# Altium schematic sheet FPGA_GTXqs.SchDoc
size B; SheetNumber: 10; SheetTotal: 11
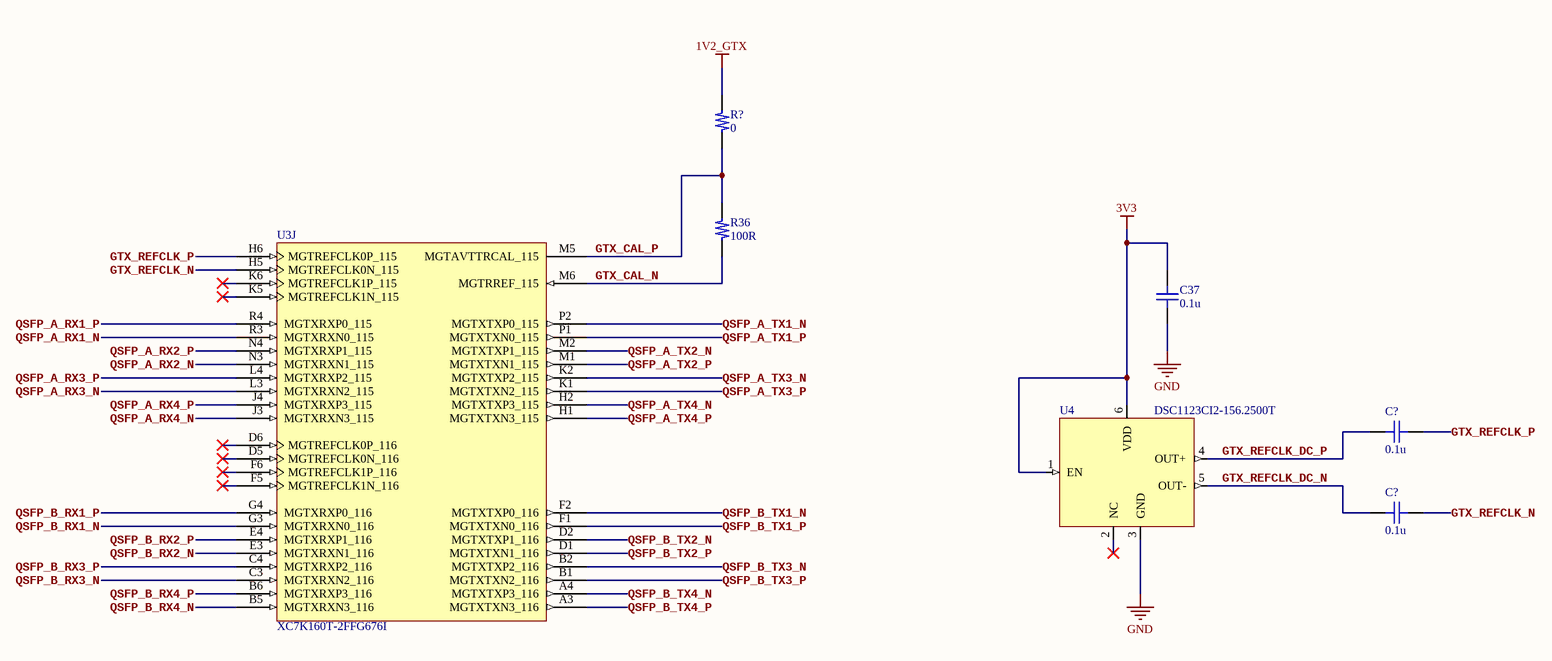
[diagram p0: FPGA_GTXqs.SchDoc]

## Parts
(Parts that share a designator on the sheet are numbered #1, #2 ... from top to bottom, then left to right.)
C37  0.1u  [C_0402_Generic]
C?#1  0.1u  [C_0402_Generic]
C?#2  0.1u  [C_0402_Generic]
R36  100R  [R_0402_Generic]
R?  0  [R_0402_Generic]
U3  XC7K160T-2FFG676I  [FFG676_(XC7K160T-2FFG676I)]  (part J of 14)
U4  DSC1123CI2-156.2500T  [Microchip_DSC1123CI2]

## Nets
1V2_GTX: R?.2
3V3: C37.2 U4.1(EN) U4.6(VDD)
GND: C37.1 U4.3(GND)
GTX_CAL_N: R36.2 U3.M6(MGTRREF_115)
GTX_CAL_P: R36.1 R?.1 U3.M5(MGTAVTTRCAL_115)
GTX_REFCLK_DC_N: C?#2.2 U4.5(OUT-)
GTX_REFCLK_DC_P: C?#1.2 U4.4(OUT+)
GTX_REFCLK_N: C?#2.1 U3.H5(MGTREFCLK0N_115)
GTX_REFCLK_P: C?#1.1 U3.H6(MGTREFCLK0P_115)
QSFP_A_RX1_N: U3.R3(MGTXRXN0_115)
QSFP_A_RX1_P: U3.R4(MGTXRXP0_115)
QSFP_A_RX2_N: U3.N3(MGTXRXN1_115)
QSFP_A_RX2_P: U3.N4(MGTXRXP1_115)
QSFP_A_RX3_N: U3.L3(MGTXRXN2_115)
QSFP_A_RX3_P: U3.L4(MGTXRXP2_115)
QSFP_A_RX4_N: U3.J3(MGTXRXN3_115)
QSFP_A_RX4_P: U3.J4(MGTXRXP3_115)
QSFP_A_TX1_N: U3.P2(MGTXTXP0_115)
QSFP_A_TX1_P: U3.P1(MGTXTXN0_115)
QSFP_A_TX2_N: U3.M2(MGTXTXP1_115)
QSFP_A_TX2_P: U3.M1(MGTXTXN1_115)
QSFP_A_TX3_N: U3.K2(MGTXTXP2_115)
QSFP_A_TX3_P: U3.K1(MGTXTXN2_115)
QSFP_A_TX4_N: U3.H2(MGTXTXP3_115)
QSFP_A_TX4_P: U3.H1(MGTXTXN3_115)
QSFP_B_RX1_N: U3.G3(MGTXRXN0_116)
QSFP_B_RX1_P: U3.G4(MGTXRXP0_116)
QSFP_B_RX2_N: U3.E3(MGTXRXN1_116)
QSFP_B_RX2_P: U3.E4(MGTXRXP1_116)
QSFP_B_RX3_N: U3.C3(MGTXRXN2_116)
QSFP_B_RX3_P: U3.C4(MGTXRXP2_116)
QSFP_B_RX4_N: U3.B5(MGTXRXN3_116)
QSFP_B_RX4_P: U3.B6(MGTXRXP3_116)
QSFP_B_TX1_N: U3.F2(MGTXTXP0_116)
QSFP_B_TX1_P: U3.F1(MGTXTXN0_116)
QSFP_B_TX2_N: U3.D2(MGTXTXP1_116)
QSFP_B_TX2_P: U3.D1(MGTXTXN1_116)
QSFP_B_TX3_N: U3.B2(MGTXTXP2_116)
QSFP_B_TX3_P: U3.B1(MGTXTXN2_116)
QSFP_B_TX4_N: U3.A4(MGTXTXP3_116)
QSFP_B_TX4_P: U3.A3(MGTXTXN3_116)

Not connected (* = marked no-connect by the designer): U3 D5(MGTREFCLK0N_116)* D6(MGTREFCLK0P_116)* F5(MGTREFCLK1N_116)* F6(MGTREFCLK1P_116)* K5(MGTREFCLK1N_115)* K6(MGTREFCLK1P_115)*; U4 2(NC)*

## Library data of the parts
C37 C?#1 C?#2 = GRM155R71C104KA88D: 0.1µF 16V X7R SMD ceramic capacitor in 0402 size; Manufacturer: Murata Electronics; Manufacturer Part Number: GRM155R71C104KA88D
R36 = ERJ-2RHD1000X: 100Ohm 0.5% 1/16W SMD resistor in 0402 size; Manufacturer: Panasonic; Manufacturer Part Number: ERJ-2RHD1000X
R? = ERJ-2GE0R00X: Jumper 0Ohm SMD resistor in 0402 size; Manufacturer: Panasonic; Manufacturer Part Number: ERJ-2GE0R00X
U3 = XC7K160T: Kintex-7 FPGA, 400 User I/Os, 8 GTX, 676-Ball BGA, Speed Grade 2, Industrial Grade, Pb-Free; Manufacturer: AMD/Xilinx; Manufacturer Part Number: XC7K160T-2FFG676I
U4 = DSC1123CI2-156.2500T: MEMS OSC XO 156.2500MHZ LVDS SMD; Manufacturer: Microchip Technology; Manufacturer Part Number: DSC1123CI2-156.2500T